# EAGLE design pcc_circuit_example (EAGLE 7.7.0)
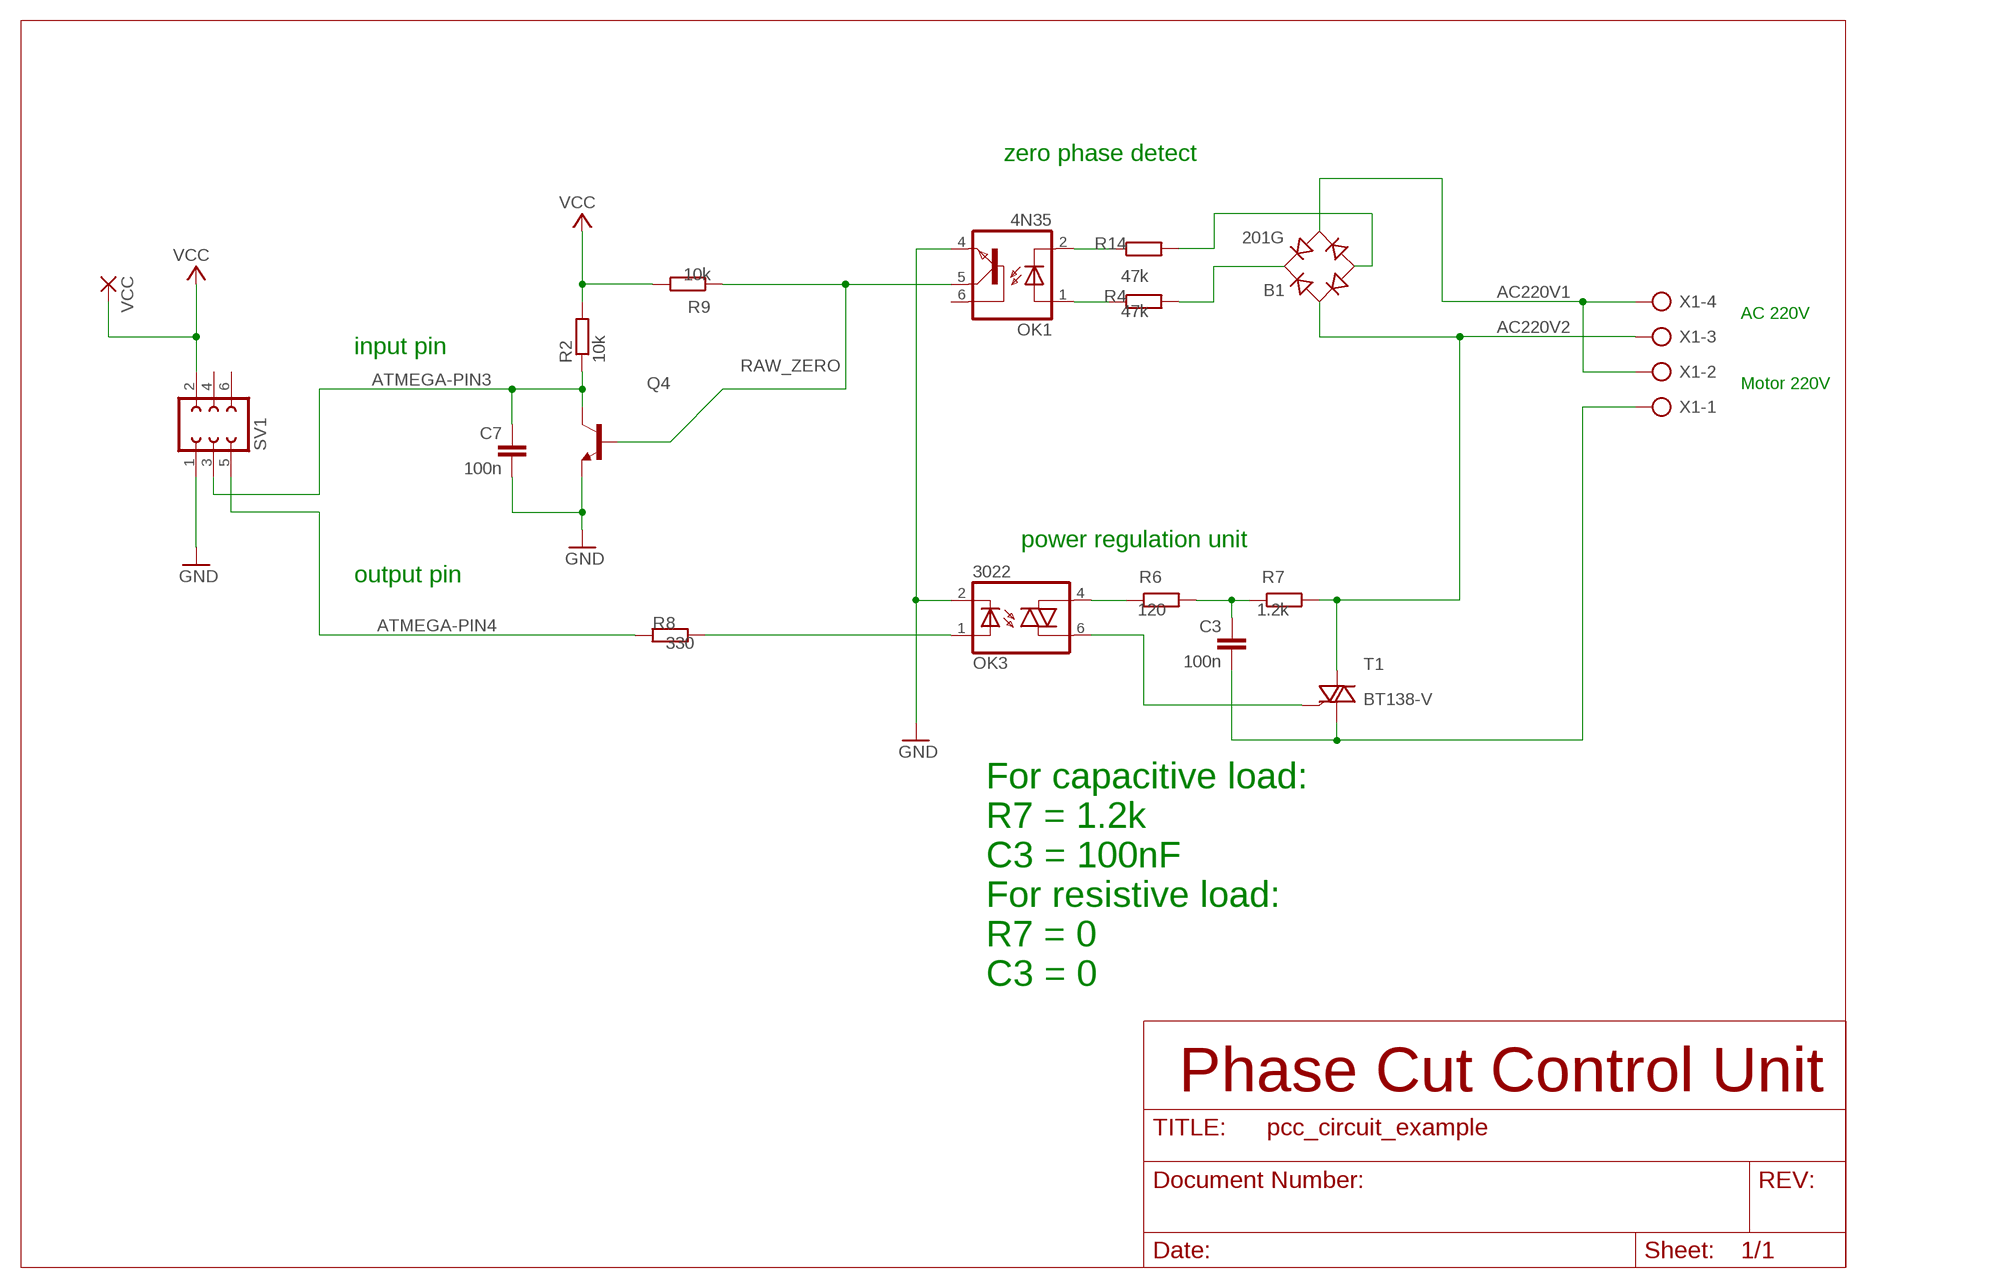
[diagram p0: schematic, sheet 1]

## Parts
B1  201G  RB1A  [RB1A]
C3  100n  C15/5  [C15B5]
C7  100n  C-55MM  [C050-024X044]
OK1  4N35  [DIL06]
OK3  3022  IL420  [DIL06]
Q4  BC548  [TO92-EBC]
R2  10k  R-EU_0207/2V  [R_0207/2V]
R4  47k  R-EU_0207/2V  [R_0207/2V]
R6  120  R-EU_0207/2V  [R_0207/2V]
R7  1.2k  R-EU_0207/2V  [R_0207/2V]
R8  330  R-EU_0207/2V  [R_0207/2V]
R9  10k  R-EU_0207/2V  [R_0207/2V]
R14  47k  R-EU_0207/2V  [R_0207/2V]
SV1  FE03-2  [FE03-2]
T1  BT138-V  [TO220V]
VCC  PAD1,6/0,8  [PAD1,6/0,8]
X1  AK300/4  [AK300/4]

## Nets
220V_LOAD: C3.2 T1.1(A1) X1.1
AC220V1: B1.AC2 X1.2 X1.4
AC220V2: B1.AC1 R7.2 T1.2(A2) X1.3
ATMEGA-PIN3: C7.1 Q4.C R2.1 SV1.3
ATMEGA-PIN4: R8.2 SV1.5
GND: C7.2 OK1.4(EMI) OK3.2(C) Q4.E SV1.1
N$3: B1.+ R4.2
N$6: B1.- R14.2
N$8: OK3.6(A2) T1.3(G)
N$9: OK1.2(C) R14.1
N$10: OK1.1(A) R4.1
N$11: OK3.1(A) R8.1
N$12: C3.1 R6.2 R7.1
N$49: OK3.4(A1) R6.1
RAW_ZERO: OK1.5(COL) Q4.B R9.1
VCC: R2.2 R9.2 SV1.2 VCC.1(P)
Unconnected: OK1.6(BAS) SV1.4 SV1.6

## Notes on the sheet
- zero phase detect
- AC 220V
- input pin
- Motor 220V
- power regulation unit
- output pin
- For capacitive load:
  R7 = 1.2k
  C3 = 100nF
  For resistive load: 
  R7 = 0
  C3 = 0
- Phase Cut Control Unit

## Library data of the parts
B1 = rectifier:RB1A: RECTIFIER 1 A
C3 = capacitor-wima:C: CAPACITOR naming: grid - package width
C7 = bauteile_jbt:C-5: standard condensator
OK1 = optocoupler:4N35: MOTOROLA OPTO COUPLER; MF: FAIRCHILD SEMICONDUCTOR; MPN: 4N35; OC_FARNELL: 1328375; OC_NEWARK: 72K9946
OK3 = optocoupler:IL420: SIEMENS OPTO COUPLER; MF: VISHAY/TELEFUNKEN; MPN: IL420; OC_FARNELL: 1469561; OC_NEWARK: 58K1719
Q4 = bauteile_jbt:BC548*: NPN Transistor
R2 R4 R6-R9 R14 = bauteile_jbt:R-EU_: RESISTOR, European symbol
SV1 = bauteile_jbt:FE03-2: FEMALE "Wannenbuchse"
T1 = bauteile_jbt:BT138: TRIAC Source: http://www.semiconductors.philips.com BT138_SERIES_2.pdf
VCC = bauteile_jbt:PAD1,6/0,8: THROUGH-HOLE PAD
X1 = bauteile_jbt:AK300/4: CONNECTOR; OC_FARNELL: unknown; OC_NEWARK: unknown

## Net classes
0 default: width 0.15 mm, drill 0.3 mm, clearance 0.205 mm

## Board
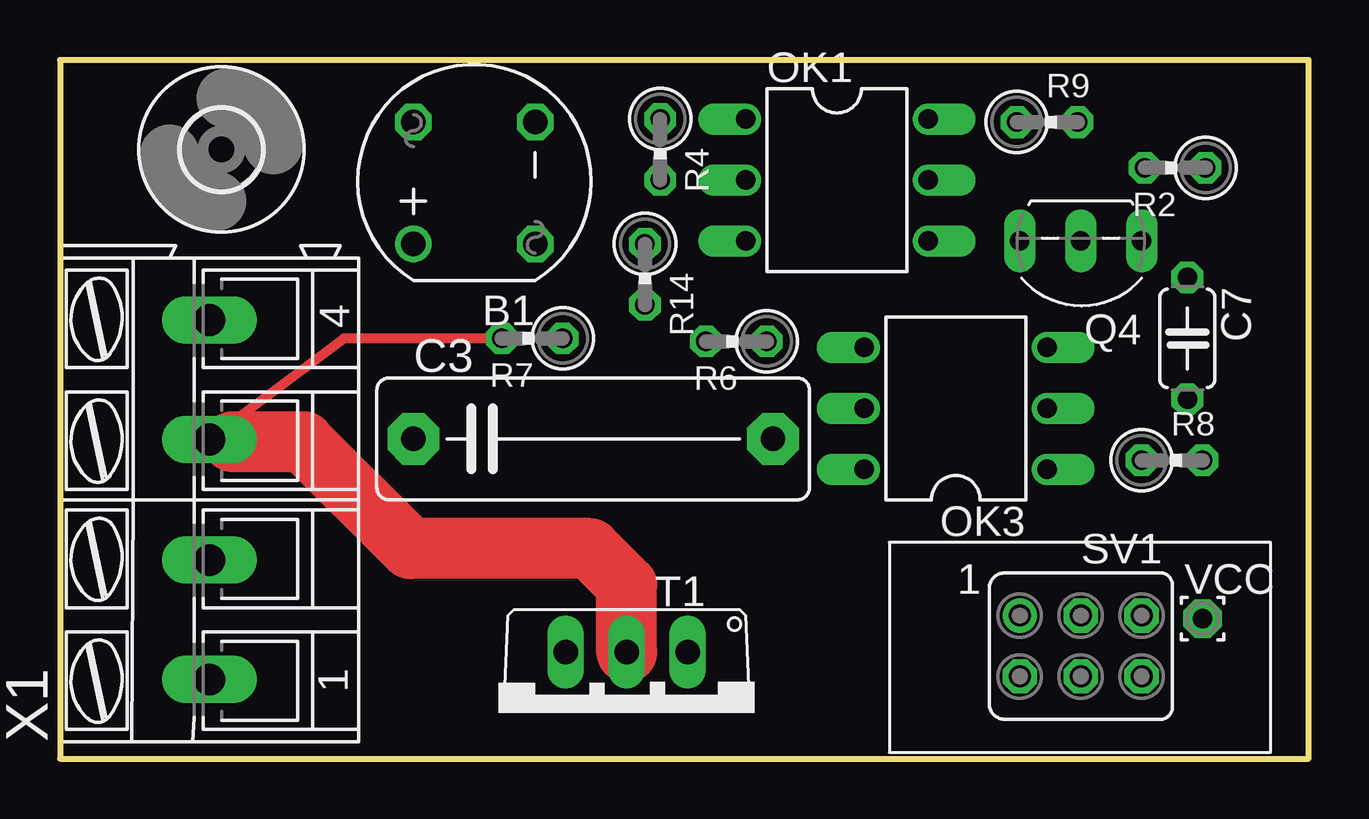
[diagram p1: board, top side]
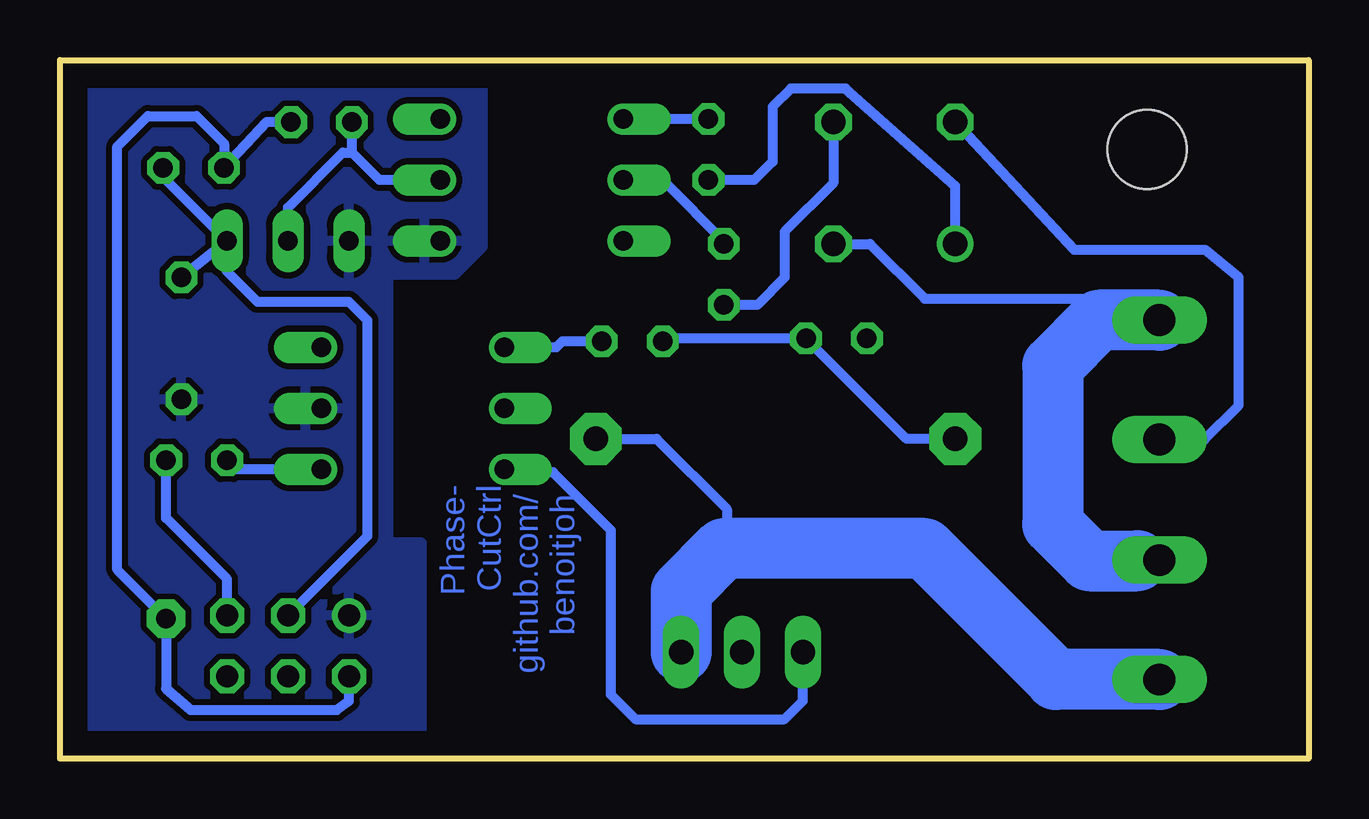
[diagram p2: board, bottom side, seen from below]

Size 52.05 x 29.13 mm. Coordinates in mm from the lower left corner, seen from the top.
Outline: 0,0 52.05,0 52.05,29.13 0,29.13 0,0
Copper layers (1*16): Top 0.035mm / dielectric 1.5mm / Bottom 0.035mm
Design rules "default": minimum track width 10mil, minimum drill 24mil, track to track 8mil, track to pad 8mil, pad to pad 8mil, via to via 8mil, smd to smd 8mil, copper to edge 40mil, drill to drill 8mil, minimum pad ring 10mil, minimum via ring 8mil, stop-mask expansion 4mil, vias tented up to drill 0mil, thermal gap 10mil

### Footprints (pad centres in the part's own frame; a part is rotated, then mirrored left to right if it is on the bottom)
RB1A = drill 1.016: + -2.54,2.54 | drill 1.016 octagon: - 2.54,-2.54; AC1 2.54,2.54; AC2 -2.54,-2.54
C15B5 = drill 1.016 pad 2.159 octagon: 1 -7.493,0; 2 7.493,0
C050-024X044 = drill 0.813 octagon: 1 -2.54,0; 2 2.54,0
DIL06 = drill 0.813 offset: 1 -2.54,-3.81; 2 0,-3.81; 3 2.54,-3.81; 4 2.54,3.81; 5 0,3.81; 6 -2.54,3.81
TO92-EBC = drill 0.813 long: B 0,-1.27; C -2.54,-1.27; E 2.54,-1.27
R_0207/2V = drill 0.813 octagon: 1 -1.27,0; 2 1.27,0
FE03-2 = drill 0.914: 1 -2.54,1.27 | drill 0.914 octagon: 2 -2.54,-1.27; 3 0,1.27; 4 0,-1.27; 5 2.54,1.27; 6 2.54,-1.27
TO220V = drill 1.016 long: 1 -2.54,-2.54; 2 0,-2.54; 3 2.54,-2.54
3,3 = hole 3.3: 0,0
PAD1,6/0,8 = drill 0.813 pad 1.6 octagon: 1 0,0
AK300/4 = drill 1.321 long: 1 -7.493,0; 2 -2.515,0; 3 2.515,0; 4 7.493,0

### Placement (x,y rotation side)
B1  17.27,24 90 top
C3  22.23,13.34 0 top
C7  46.99,17.53 270 top
OK1  32.38,24.13 270 top
OK3  37.34,14.61 90 top
Q4  42.55,20.32 180 top
R2  46.48,24.64 180 top
R4  25.02,25.4 270 top
R6  28.19,17.4 180 top
R7  19.68,17.53 180 top
R8  46.35,12.45 0 top
R9  41.15,26.54 0 top
R14  24.38,20.19 270 top
SV1  42.55,4.7 0 top
T1  23.62,1.91 180 top
U$3  [3,3]  6.73,25.4 0 top
VCC  47.62,5.84 0 top
X1  6.22,10.79 90 top

### Tracks (layer width: path | path; a pad name or v marks a point on that pad's centre or on a via)
220V_LOAD
  Bottom 0.406: T1.1 26.16,6.86 | C3.2 27.18,13.34 24.26,10.41 24.26,8.76
  Bottom 2.54: X1.1 10.54,3.3 16,8.76 24.26,8.76 24.38,8.76 26.16,6.99 T1.1
AC220V1
  Bottom 0.406: B1.AC2 18.29,21.46 16,19.18 8,19.18 X1.4
  Bottom 1.524: 7.14,8.26 X1.2
  Bottom 2.54: X1.4 8.76,18.29 10.67,16.38 10.67,9.78 9.14,8.26 7.14,8.26
AC220V2
  Top 0.406: R7.2 11.84,17.53 X1.3
  Top 1.93: 7.21,13.21 X1.3
  Top 2.54: T1.2 23.62,7.24 22.1,8.76 14.61,8.76 10.16,13.21 7.21,13.21
  Bottom 0.406: B1.AC1 9.78,21.21 4.32,21.21 2.92,20.07 2.92,14.73 4.34,13.31 X1.3
ATMEGA-PIN3
  Bottom 0.406: Q4.C C7.1 | Q4.C 45.09,20.32 43.81,19.05 40.01,19.05 39.24,18.29 39.24,9.27 SV1.3 | R2.1 47.62,24.13 Q4.C
ATMEGA-PIN4
  Bottom 0.406: SV1.5 45.09,7.49 47.62,10.03 R8.2
GND
  pour Bottom (isolate 0.254): 34.92,28.32 50.93,28.45 50.93,1.02 36.96,1.02 36.96,9.02 38.35,9.02 38.35,20.19 35.56,20.19 34.42,21.34 34.42,28.32
N$3
  Bottom 0.406: B1.+ 14.73,23.88 19.3,27.94 21.59,27.94 22.35,27.18 22.35,24.89 23.11,24.13 R4.2
N$6
  Bottom 0.406: B1.- 19.81,24 21.84,21.97 21.84,20.07 22.99,18.92 R14.2
N$8
  Bottom 0.406: T1.3 21.08,2.41 21.84,1.65 28.07,1.65 29.08,2.67 29.08,9.53 31.5,11.94 33.53,11.94 OK3.6
N$9
  Bottom 0.406: R14.1 24.38,21.59 26.8,24 28.45,24 OK1.2
N$10
  Bottom 0.406: R4.1 OK1.1
N$11
  Bottom 0.406: OK3.1 44.7,12.06 R8.1
N$12
  Bottom 0.406: C3.1 16.76,13.34 R7.1 26.8,17.53 R6.2
N$49
  Bottom 0.406: R6.1 31.11,17.4 31.37,17.14 OK3.4
RAW_ZERO
  Bottom 0.406: OK1.5 38.73,24.13 39.88,25.27 | 39.88,25.27 R9.1 | Q4.B 42.55,22.99 40.26,25.27 39.88,25.27
VCC
  Bottom 0.406: R9.2 43.43,26.54 R2.2 45.21,25.65 46.35,26.8 48.39,26.8 49.66,25.53 49.66,7.87 VCC.1 47.62,2.92 46.61,2.03 40.51,2.03 40.01,2.41 SV1.2

### Text on the board
Bottom: Phase- / CutCtrl / github.com/ / benoitjoh
tValues: R1 | C1 | HIGH / VOLTAGE
bValues: AC in | for resistive load: / no C1, R1=0 | GND | p0 | pcc | Load | VCC